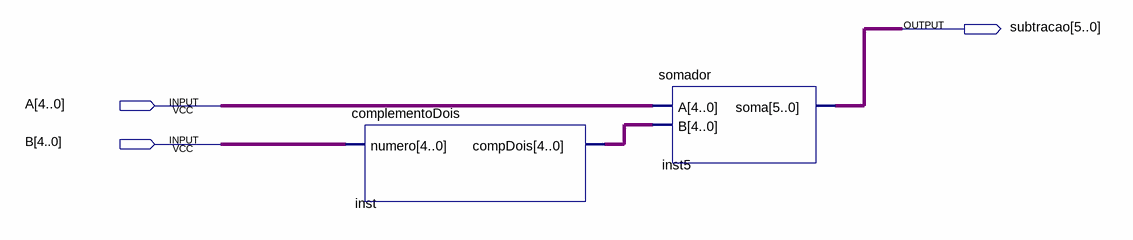
[diagram p0: schematic sheet]
// Quartus schematic subtrator.bdf as structural Verilog: 2 symbols, 3 pins
module subtrator (
  input  [4:0] A,
  input  [4:0] B,
  output [5:0] subtracao
);

  wire [4:0] inst_compdois;

  complementoDois inst (.numero(B), .compDois(inst_compdois));
  somador inst5 (.A(A), .B(inst_compdois), .soma(subtracao));
endmodule
